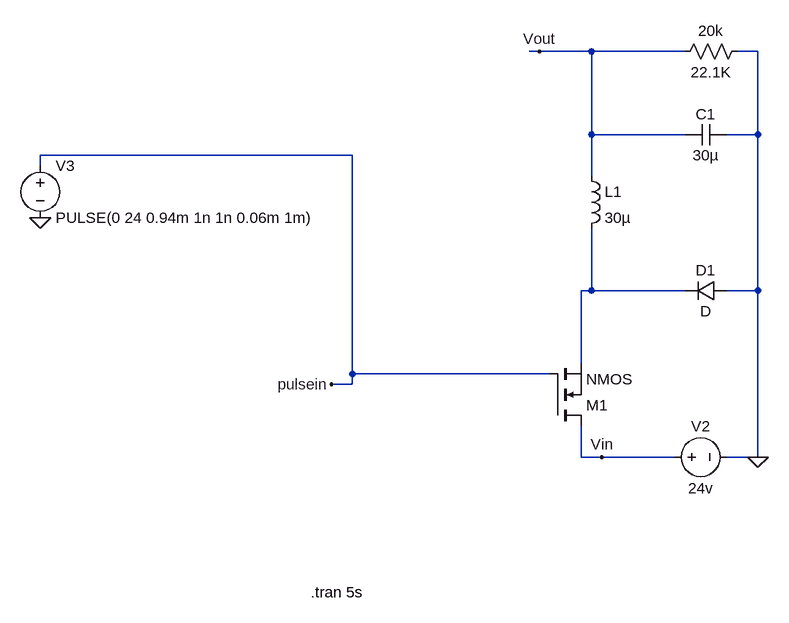
[diagram p0: schematic Krish____.asc]
Krish____.asc, the LTspice schematic file:
Version 4
SHEET 1 880 680
WIRE 320 -864 304 -864
WIRE 400 -864 320 -864
WIRE 544 -864 400 -864
WIRE 656 -864 624 -864
WIRE 400 -736 400 -864
WIRE 544 -736 400 -736
WIRE 656 -736 656 -864
WIRE 656 -736 608 -736
WIRE 32 -704 -448 -704
WIRE -448 -688 -448 -704
WIRE 400 -672 400 -736
WIRE 400 -496 400 -592
WIRE 400 -496 384 -496
WIRE 544 -496 400 -496
WIRE 656 -496 656 -736
WIRE 656 -496 608 -496
WIRE 384 -384 384 -496
WIRE 32 -368 32 -704
WIRE 336 -368 32 -368
WIRE 32 -352 32 -368
WIRE 32 -352 0 -352
WIRE 384 -240 384 -288
WIRE 416 -240 384 -240
WIRE 528 -240 416 -240
WIRE 656 -240 656 -496
WIRE 656 -240 608 -240
FLAG 656 -240 0
FLAG -448 -608 0
FLAG 320 -864 Vout
FLAG 416 -240 Vin
FLAG 0 -352 pulsein
SYMBOL nmos 336 -288 M180
SYMATTR InstName M1
SYMBOL voltage 512 -240 R270
WINDOW 0 32 56 VTop 2
WINDOW 3 -32 56 VBottom 2
WINDOW 123 0 0 Left 0
WINDOW 39 0 0 Left 0
SYMATTR InstName V2
SYMATTR Value 24v
SYMBOL diode 608 -512 R90
WINDOW 0 0 32 VBottom 2
WINDOW 3 32 32 VTop 2
SYMATTR InstName D1
SYMBOL ind 384 -688 R0
SYMATTR InstName L1
SYMATTR Value 30µ
SYMBOL cap 608 -752 R90
WINDOW 0 0 32 VBottom 2
WINDOW 3 32 32 VTop 2
SYMATTR InstName C1
SYMATTR Value 30µ
SYMBOL res 640 -880 R90
WINDOW 0 0 56 VBottom 2
WINDOW 3 32 56 VTop 2
SYMATTR InstName 20k
SYMATTR Value 22.1K
SYMATTR SpiceLine tol=1 pwr=0.1
SYMBOL voltage -448 -704 R0
WINDOW 123 0 0 Left 0
WINDOW 39 0 0 Left 0
SYMATTR InstName V3
SYMATTR Value PULSE(0 24 0.94m 1n 1n 0.06m 1m)
TEXT -32 -32 Left 2 !.tran 5s

The netlist it stands for:
* Krish____.asc
M1 Vin pulsein N001 N001 NMOS
V2 Vin 0 24v
D1 0 N001 D
L1 Vout N001 30µ
C1 0 Vout 30µ
R§20k 0 Vout 22.1K tol=1 pwr=0.1
V3 pulsein 0 PULSE(0 24 0.94m 1n 1n 0.06m 1m)
.model D D
.lib standard.dio
.model NMOS NMOS
.model PMOS PMOS
.lib standard.mos
.tran 5s
.backanno
.end